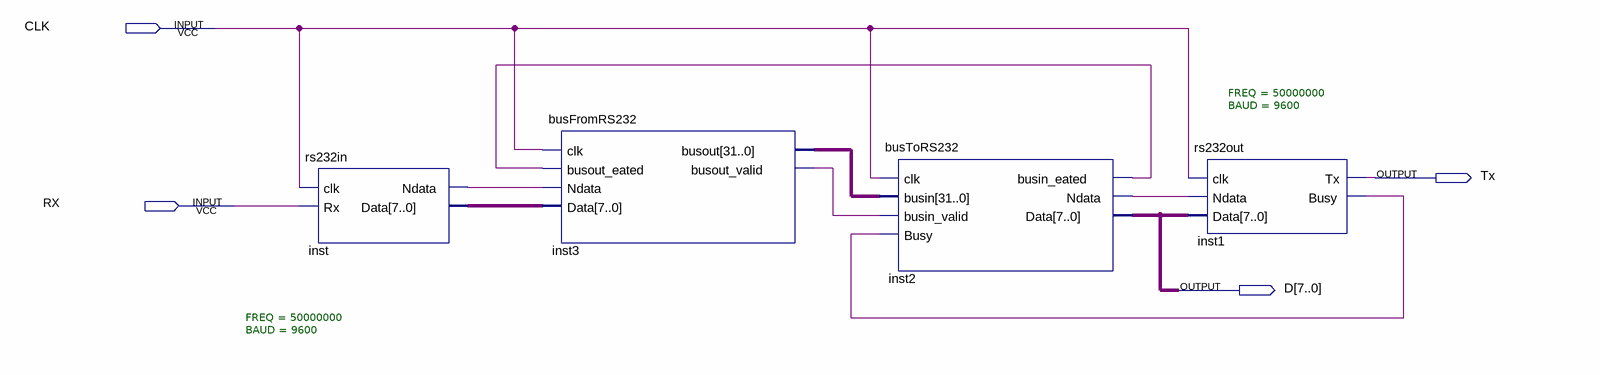
[diagram p0: schematic sheet]
// Quartus schematic Schema.bdf as structural Verilog: 4 symbols, 4 pins
module Schema (
  input  CLK,
  input  RX,
  output Tx,
  output [7:0] D
);

  wire inst1_busy, inst2_busin_eated, inst2_ndata, inst3_busout_valid, inst_ndata;
  wire [7:0] inst_data;
  wire [31:0] inst3_busout;

  rs232in #(.FREQ(50000000), .BAUD(9600)) inst (.clk(CLK), .Rx(RX), .Ndata(inst_ndata), .Data(inst_data));
  busFromRS232 inst3 (
    .clk(CLK), .busout_eated(inst2_busin_eated), .Ndata(inst_ndata), .Data(inst_data), .busout(inst3_busout),
    .busout_valid(inst3_busout_valid));
  busToRS232 inst2 (
    .clk(CLK), .busin(inst3_busout), .busin_valid(inst3_busout_valid), .Busy(inst1_busy),
    .busin_eated(inst2_busin_eated), .Ndata(inst2_ndata), .Data(D));
  rs232out #(.FREQ(50000000), .BAUD(9600)) inst1 (.clk(CLK), .Ndata(inst2_ndata), .Data(D), .Tx(Tx), .Busy(inst1_busy));
endmodule
